# Altium schematic sheet Sheet1.SchDoc: N64 Controller
size A4; Author: TheComet; Revision: 1.0.0; ProjectName: N64 Controller
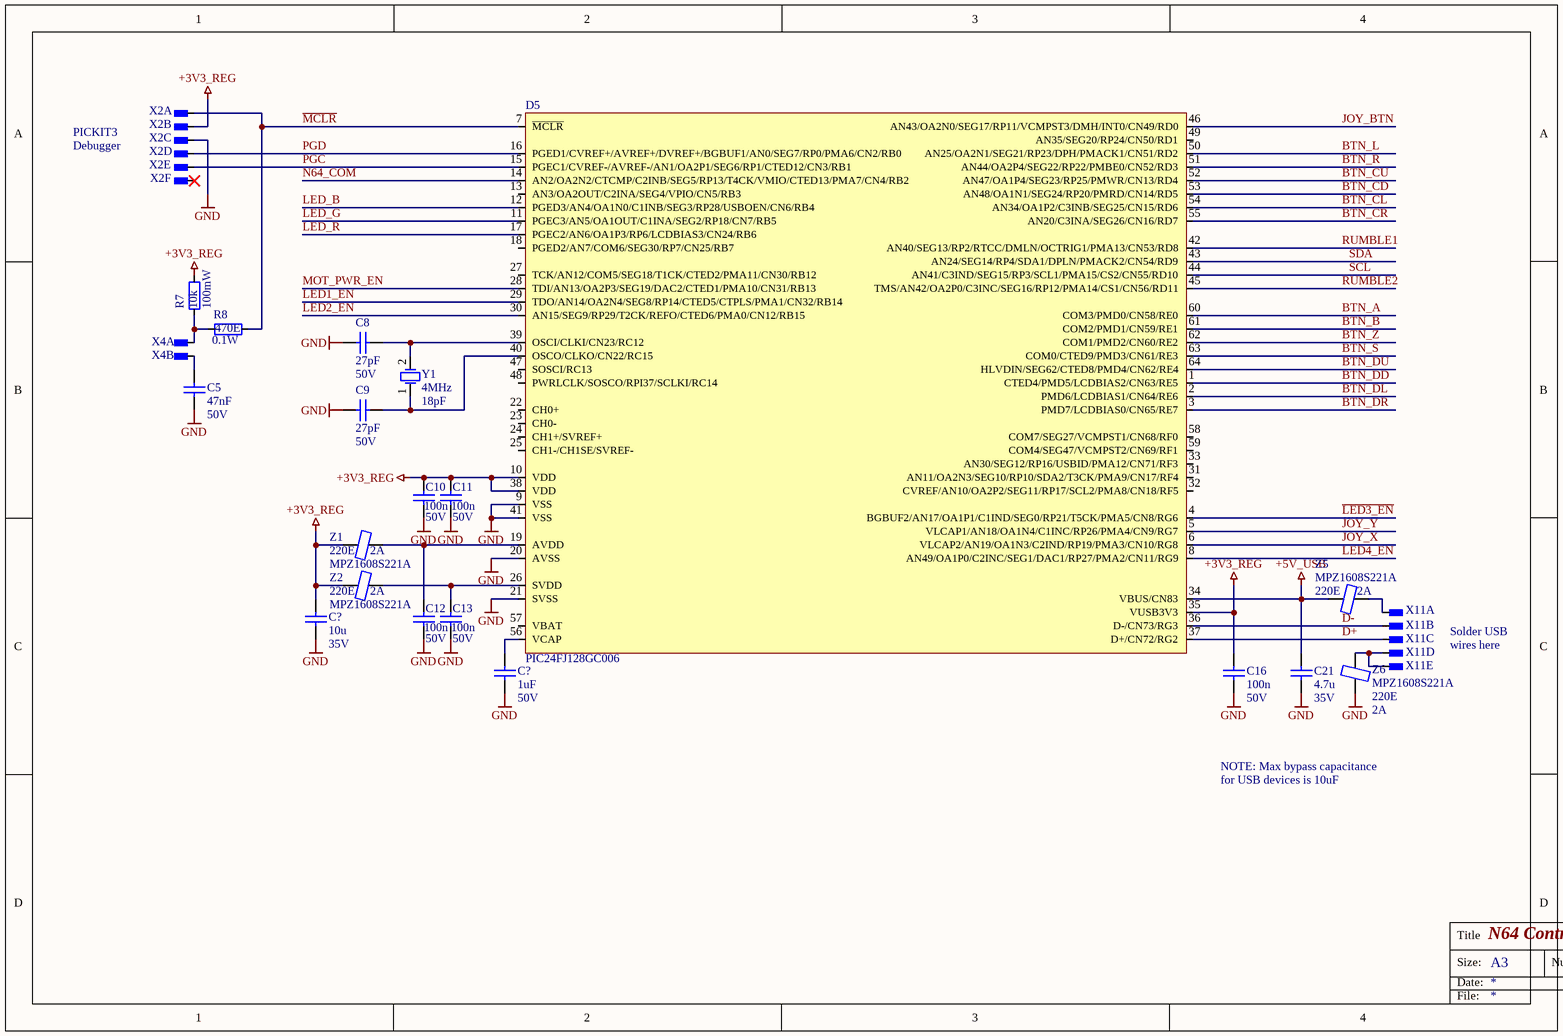
[diagram p0: Sheet1.SchDoc]

## Parts
(Parts that share a designator on the sheet are numbered #1, #2 ... from top to bottom, then left to right.)
C5  value 47nF  Value2: 50V  [SMD_0603]  (hidden comment: C_SMD_CER_47N_50V_10%_X7R_0603)
C8  value 27pF  Value2: 50V  [SMD_0603]  (hidden comment: C_SMD_CER_27P_50V_5%_X7R_0603)
C9  value 27pF  Value2: 50V  [SMD_0603]  (hidden comment: C_SMD_CER_27P_50V_5%_X7R_0603)
C10  value 100n  Value2: 50V  [SMD_0603]  (hidden comment: C_SMD_CER_100N_50V_10%_X7R_0603)
C11  value 100n  Value2: 50V  [SMD_0603]  (hidden comment: C_SMD_CER_100N_50V_10%_X7R_0603)
C12  value 100n  Value2: 50V  [SMD_0603]  (hidden comment: C_SMD_CER_100N_50V_10%_X7R_0603)
C13  value 100n  Value2: 50V  [SMD_0603]  (hidden comment: C_SMD_CER_100N_50V_10%_X7R_0603)
C16  value 100n  Value2: 50V  [SMD_0603]  (hidden comment: C_SMD_CER_100N_50V_10%_X7R_0603)
C21  value 4.7u  Value2: 35V  [SMD_0805]  (hidden comment: C_SMD_CER_4U7_35V_10%_X7R_0805)
C?#1  value 10u  Value2: 35V  [SMD_1206]  (hidden comment: C_SMD_CER_10U_35V_10%_X5R_1206)
C?#2  value 1uF  Value2: 50V  [SMD_0805]  (hidden comment: C_SMD_CER_1U_50V_10%_X7R_0805)
D5  Type: PIC24FJ128GC006  [SMD_TQFP-64]  (hidden comment: D_PIC24FJ128GC006_TQFP-64)
R7  value 10k  Value2: 100mW  [SMD_0603]  (hidden comment: R_SMD_THINFILM_10K_0W1_1%_50PPM_0603)
R8  value 470E  Value2: 0.1W  [SMD_0603]  (hidden comment: R_SMD_THINFILM_470E_0W1_1%_50PPM_0603)
X2  X_CONNECTOR_P2.54_D0.9_1X6  [THT_CON_P2.54_D0.9_1X6]  (value not drawn)  (parts A,B,C,D,E,F of 6)
X4  X_CONNECTOR_P2.54_D0.9_1X2  [THT_CON_P2.54_D0.9_1X2]  (value not drawn)  (parts A,B of 2)
X11  X_CONNECTOR_P2.54_D0.9_1X5  [THT_CON_P2.54_D0.9_1X5]  (value not drawn)  (parts A,B,C,D,E of 5)
Y1  value 4MHz  Load Capacitance: 18pF  [SMD_QUARZ_HC49]  (hidden comment: G_SMD_OSC_XTAL_4MHZ_11.4MM_4.35MM)
Z1  value 220E  Type: MPZ1608S221A  Value2: 2A  [SMD_0603]  (hidden comment: Z_SMD_FERRITE_2A_220E@100MHZ_0603)
Z2  value 220E  Type: MPZ1608S221A  Value2: 2A  [SMD_0603]  (hidden comment: Z_SMD_FERRITE_2A_220E@100MHZ_0603)
Z5  value 220E  Type: MPZ1608S221A  Value2: 2A  [SMD_0603]  (hidden comment: Z_SMD_FERRITE_2A_220E@100MHZ_0603)
Z6  value 220E  Type: MPZ1608S221A  Value2: 2A  [SMD_0603]  (hidden comment: Z_SMD_FERRITE_2A_220E@100MHZ_0603)

## Nets
+3V3_REG: C10.2 C11.2 C16.2 C?#1.2 D5.10(VDD) D5.35(VUSB3V3) D5.38(VDD) R7.2 X2.2 Z1.1 Z2.1
+5V_USB: C21.2 D5.34(VBUS/CN83) Z5.1
GND: C5.1 C8.1 C9.1 C10.1 C11.1 C12.1 C13.1 C16.1 C21.1 C?#1.1 C?#2.1 D5.9(VSS) D5.20(AVSS) D5.21(SVSS) D5.41(VSS) X2.3 Z6.1
BTN_A: D5.60(COM3/PMD0/CN58/RE0)
BTN_B: D5.61(COM2/PMD1/CN59/RE1)
BTN_CD: D5.53(AN48/OA1N1/SEG24/RP20/PMRD/CN14/RD5)
BTN_CL: D5.54(AN34/OA1P2/C3INB/SEG25/CN15/RD6)
BTN_CR: D5.55(AN20/C3INA/SEG26/CN16/RD7)
BTN_CU: D5.52(AN47/OA1P4/SEG23/RP25/PMWR/CN13/RD4)
BTN_DD: D5.1(CTED4/PMD5/LCDBIAS2/CN63/RE5)
BTN_DL: D5.2(PMD6/LCDBIAS1/CN64/RE6)
BTN_DR: D5.3(PMD7/LCDBIAS0/CN65/RE7)
BTN_DU: D5.64(HLVDIN/SEG62/CTED8/PMD4/CN62/RE4)
BTN_L: D5.50(AN25/OA2N1/SEG21/RP23/DPH/PMACK1/CN51/RD2)
BTN_R: D5.51(AN44/OA2P4/SEG22/RP22/PMBE0/CN52/RD3)
BTN_S: D5.63(COM0/CTED9/PMD3/CN61/RE3)
BTN_Z: D5.62(COM1/PMD2/CN60/RE2)
D+: D5.37(D+/CN72/RG2) X11.3
D-: D5.36(D-/CN73/RG3) X11.2
JOY_BTN: D5.46(AN43/OA2N0/SEG17/RP11/VCMPST3/DMH/INT0/CN49/RD0)
JOY_X: D5.6(VLCAP2/AN19/OA1N3/C2IND/RP19/PMA3/CN10/RG8)
JOY_Y: D5.5(VLCAP1/AN18/OA1N4/C1INC/RP26/PMA4/CN9/RG7)
~{LED1_EN}: D5.29(TDO/AN14/OA2N4/SEG8/RP14/CTED5/CTPLS/PMA1/CN32/RB14)
~{LED2_EN}: D5.30(AN15/SEG9/RP29/T2CK/REFO/CTED6/PMA0/CN12/RB15)
~{LED3_EN}: D5.4(BGBUF2/AN17/OA1P1/C1IND/SEG0/RP21/T5CK/PMA5/CN8/RG6)
~{LED4_EN}: D5.8(AN49/OA1P0/C2INC/SEG1/DAC1/RP27/PMA2/CN11/RG9)
LED_B: D5.12(PGED3/AN4/OA1N0/C1INB/SEG3/RP28/USBOEN/CN6/RB4)
LED_G: D5.11(PGEC3/AN5/OA1OUT/C1INA/SEG2/RP18/CN7/RB5)
LED_R: D5.17(PGEC2/AN6/OA1P3/RP6/LCDBIAS3/CN24/RB6)
~{MCLR}: D5.7(~{MCLR}) R8.2 X2.1
MOT_PWR_EN: D5.28(TDI/AN13/OA2P3/SEG19/DAC2/CTED1/PMA10/CN31/RB13)
N64_COM: D5.14(AN2/OA2N2/CTCMP/C2INB/SEG5/RP13/T4CK/VMIO/CTED13/PMA7/CN4/RB2)
PGC: D5.15(PGEC1/CVREF-/AVREF-/AN1/OA2P1/SEG6/RP1/CTED12/CN3/RB1) X2.5
PGD: D5.16(PGED1/CVREF+/AVREF+/DVREF+/BGBUF1/AN0/SEG7/RP0/PMA6/CN2/RB0) X2.4
RUMBLE1: D5.42(AN40/SEG13/RP2/RTCC/DMLN/OCTRIG1/PMA13/CN53/RD8)
RUMBLE2: D5.45(TMS/AN42/OA2P0/C3INC/SEG16/RP12/PMA14/CS1/CN56/RD11)
SCL: D5.44(AN41/C3IND/SEG15/RP3/SCL1/PMA15/CS2/CN55/RD10)
SDA: D5.43(AN24/SEG14/RP4/SDA1/DPLN/PMACK2/CN54/RD9)
NetC5_2: C5.2 X4.2
NetC8_2: C8.2 D5.39(OSCI/CLKI/CN23/RC12) Y1.2(OSC2)
NetC9_2: C9.2 D5.40(OSCO/CLKO/CN22/RC15) Y1.1(OSC1)
NetC12_2: C12.2 D5.19(AVDD) Z1.2
NetC13_2: C13.2 D5.26(SVDD) Z2.2
NetC?#2_2: C?#2.2 D5.56(VCAP)
NetR7_1: R7.1 R8.1 X4.1
NetX11_1: X11.1 Z5.2
NetX11_4: X11.4 X11.5 Z6.2

Not connected (* = marked no-connect by the designer): D5 13(AN3/OA2OUT/C2INA/SEG4/VPIO/CN5/RB3) 18(PGED2/AN7/COM6/SEG30/RP7/CN25/RB7) 22(CH0+) 23(CH0-) 24(CH1+/SVREF+) 25(CH1-/CH1SE/SVREF-) 27(TCK/AN12/COM5/SEG18/T1CK/CTED2/PMA11/CN30/RB12) 31(AN11/OA2N3/SEG10/RP10/SDA2/T3CK/PMA9/CN17/RF4) 32(CVREF/AN10/OA2P2/SEG11/RP17/SCL2/PMA8/CN18/RF5) 33(AN30/SEG12/RP16/USBID/PMA12/CN71/RF3) 47(SOSCI/RC13) 48(PWRLCLK/SOSCO/RPI37/SCLKI/RC14) 49(AN35/SEG20/RP24/CN50/RD1) 57(VBAT) 58(COM7/SEG27/VCMPST1/CN68/RF0) 59(COM4/SEG47/VCMPST2/CN69/RF1); X2 6*

## Notes on the sheet
- PICKIT3
- Debugger
- Solder USB
- wires here
- NOTE: Max bypass capacitance
- for USB devices is 10uF
- Title
- Size:
- Date:
- A3
- Number:
- Time:
- Revision:
- Sheet
- of
- File:

## Library data of the parts
C5 = C_SMD_CER_47N_50V_10%_X7R_0603: SMD capacitor; Supplier - E+H-flowtec SAP: 50092746; Supllier - Digikey: 1276-1063-1-ND
C8 C9 = C_SMD_CER_27P_50V_5%_X7R_0603: CAP CER 27PF 50V X7R 0603; Supplier - Digikey: 478-11825-1-ND
C10-C13 C16 = C_SMD_CER_100N_50V_10%_X7R_0603: SMD Capacitor; Supplier - E+H-flowtec SAP: 50092748; Supplier - Digikey: 1276-1936-1-ND
C21 = C_SMD_CER_4U7_35V_10%_X7R_0805: SMD Capacitor, Ceramic; Supplier - Digikey: 445-172479-1-ND
C?#1 = C_SMD_CER_10U_35V_10%_X5R_1206: SMD Capacitor, 10uF, 35V, 1206; Supplier - E+H-flowtec SAP: 71195846
D5 = D_PIC24FJ128GC006_TQFP-64: IC MCU 16BIT 128KB FLASH 64TQFP; Supplier - Digikey: PIC24FJ128GC006-I/PT-ND
R7 = R_SMD_THINFILM_10K_0W1_1%_50PPM_0603: SMD Resistor; Supplier - E+H-flowtec SAP: 50092700; Supplier - Digikey: YAG2321CT-ND
R8 = R_SMD_THINFILM_470E_0W1_1%_50PPM_0603: SMD Resistor; Supplier - E+H-flowtec SAP: 50092681
X2 = X_CONNECTOR_P2.54_D0.9_1X6: Pitch 2.54, Diameter 0.9mm, 1 row, 6 columns; Type: Pitch 2.54, Diameter 0.9mm, 1 row, 3 columns
X4 = X_CONNECTOR_P2.54_D0.9_1X2: Pitch 2.54, Diameter 0.9mm, 1 row, 2 columns; Type: Pitch 2.54, Diameter 0.9mm, 1 row, 2 columns
X11 = X_CONNECTOR_P2.54_D0.9_1X5: Pitch 2.54, Diameter 0.9mm, 1 row, 5 columns; Type: Pitch 2.54, Diameter 0.9mm, 1 row, 3 columns
Y1 = G_SMD_OSC_XTAL_4MHZ_11.4MM_4.35MM: SMD XTAL; Distributor - Farnell: 1842332
Z1 Z2 Z5 Z6 = Z_SMD_FERRITE_2A_220E@100MHZ_0603: Ferrite Beads; Supplier - E+H Flowtec AG: 50104604
C?#2 = C_SMD_CER_1U_50V_10%_X7R_0805: Supplier - Digikey: 587-2910-1-ND